# EAGLE design dresden_breakout_v04 (EAGLE 5.10)
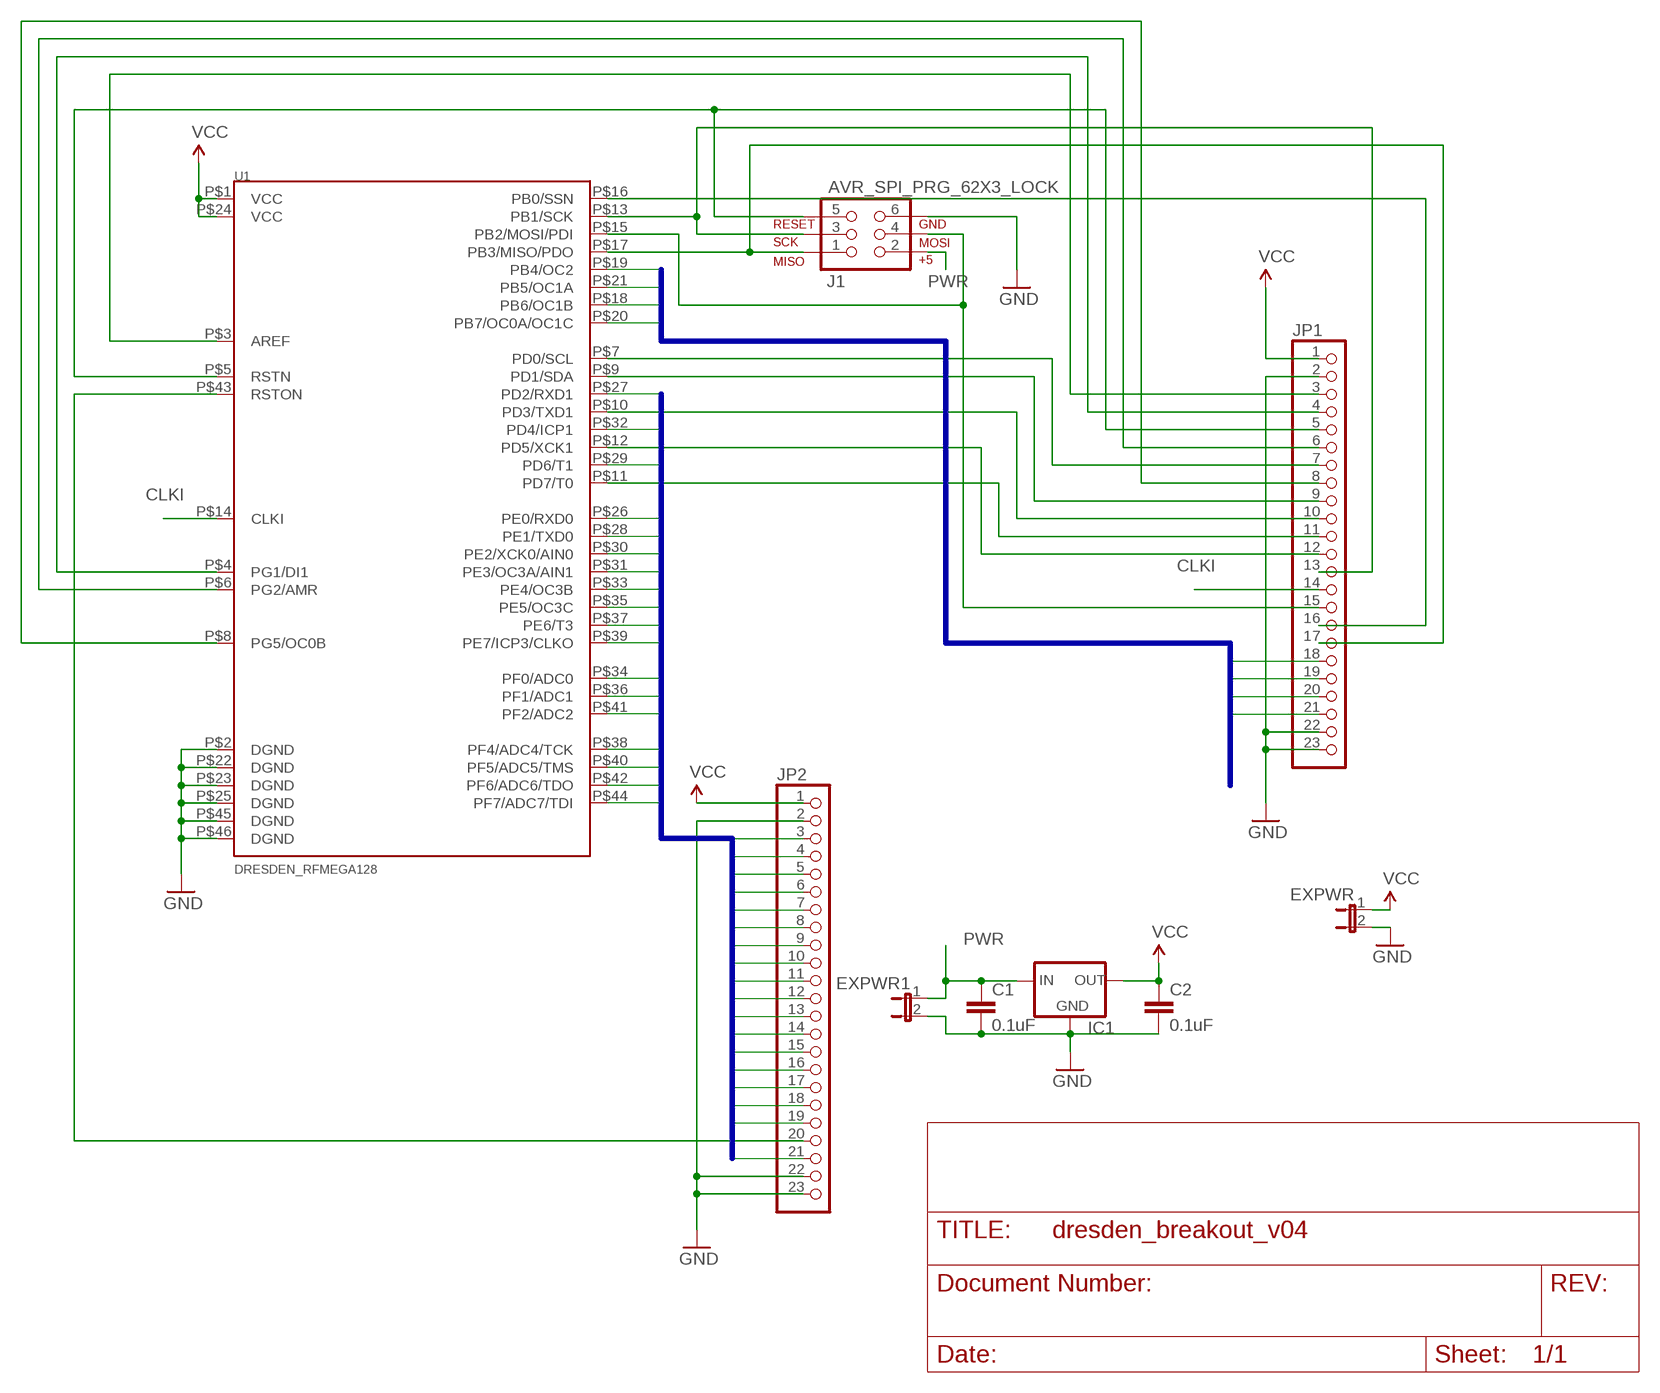
[diagram p0: schematic, sheet 1]

## Parts
C1  0.1uF  C-EU050-035X075  [C050-035X075]
C2  0.1uF  C-EU050-035X075  [C050-035X075]
EXPWR  JUMPER2  [JUMPER2]
EXPWR1  JUMPER2  [JUMPER2]
IC1  MCP1700INLINE  [TO92-INLINE]
J1  AVR_SPI_PRG_62X3_LOCK  [2X3_LOCK]
JP1  PINHD-1X23NS  [1X23-NS]
JP2  PINHD-1X23NS  [1X23-NS]
U1  DRESDEN_RFMEGA128  [DRESDEN-DERFMEGA128-TOPSIDE]

## Nets
CLKI: JP1.14 U1.P$14(CLKI)
GND: C1.2 C2.2 EXPWR1.2 EXPWR.2 IC1.1(GND) J1.6 JP1.2 JP1.22 JP1.23 JP2.2 JP2.22 JP2.23 U1.P$2(DGND) U1.P$22(DGND) U1.P$23(DGND) U1.P$25(DGND) U1.P$45(DGND) U1.P$46(DGND)
MISO: J1.1 JP1.17 U1.P$17(PB3/MISO/PDO)
MOSI: J1.4 JP1.15 U1.P$15(PB2/MOSI/PDI)
N$1: JP1.7 U1.P$7(PD0/SCL)
N$2: JP1.12 U1.P$12(PD5/XCK1)
N$54: JP2.20 U1.P$43(RSTON)
N$65: JP1.9 U1.P$9(PD1/SDA)
N$66: JP1.3 U1.P$3(AREF)
N$67: JP1.4 U1.P$4(PG1/DI1)
N$68: JP1.6 U1.P$6(PG2/AMR)
N$69: JP1.8 U1.P$8(PG5/OC0B)
N$70: JP1.10 U1.P$10(PD3/TXD1)
N$72: JP1.11 U1.P$11(PD7/T0)
N$74: JP1.16 U1.P$16(PB0/SSN)
PIN18: JP1.18 U1.P$18(PB6/OC1B)
PIN19: JP1.19 U1.P$19(PB4/OC2)
PIN20: JP1.20 U1.P$20(PB7/OC0A/OC1C)
PIN21: JP1.21 U1.P$21(PB5/OC1A)
PIN26: JP2.3 U1.P$26(PE0/RXD0)
PIN27: JP2.4 U1.P$27(PD2/RXD1)
PIN28: JP2.5 U1.P$28(PE1/TXD0)
PIN29: JP2.6 U1.P$29(PD6/T1)
PIN30: JP2.7 U1.P$30(PE2/XCK0/AIN0)
PIN31: JP2.8 U1.P$31(PE3/OC3A/AIN1)
PIN32: JP2.9 U1.P$32(PD4/ICP1)
PIN33: JP2.10 U1.P$33(PE4/OC3B)
PIN34: JP2.11 U1.P$34(PF0/ADC0)
PIN35: JP2.12 U1.P$35(PE5/OC3C)
PIN36: JP2.13 U1.P$36(PF1/ADC1)
PIN37: JP2.14 U1.P$37(PE6/T3)
PIN38: JP2.15 U1.P$38(PF4/ADC4/TCK)
PIN39: JP2.16 U1.P$39(PE7/ICP3/CLKO)
PIN40: JP2.17 U1.P$40(PF5/ADC5/TMS)
PIN41: JP2.18 U1.P$41(PF2/ADC2)
PIN42: JP2.19 U1.P$42(PF6/ADC6/TDO)
PIN44: JP2.21 U1.P$44(PF7/ADC7/TDI)
PWR: C1.1 EXPWR1.1 IC1.2(IN) J1.2
RESET: J1.5 JP1.5 U1.P$5(RSTN)
SCK: J1.3 JP1.13 U1.P$13(PB1/SCK)
VCC: C2.1 EXPWR.1 IC1.3(OUT) JP1.1 JP2.1 U1.P$1(VCC) U1.P$24(VCC)

## Buses
PIN[18..21]
PIN[26..42],PIN44

## Library data of the parts
C1 C2 = rcl:C-EU: CAPACITOR, European symbol
EXPWR EXPWR1 = microbuilder:JUMPER2: JUMPER - 2 Pins
IC1 = adafruit:MCP1700: VOLTAGE REGULATOR
J1 = SparkFun:AVR_SPI_PRG_6: AVR ISP 6 Pin This is the reduced ISP connector for AVR programming. Common on Arduino. This footprint will take up less PCB space and can be used with a 10-pin to 6-pin adapter such as SKU: BOB-08508
JP1 JP2 = karlnet-parts:PINHD-1X23: PIN HEADER
U1 = karlnet-parts:DRESDEN_RFMEGA128: This is a modified ATmega128RFA1 part, to to match Dresden Elektronik's deRFmega128-22XX modules

## Board
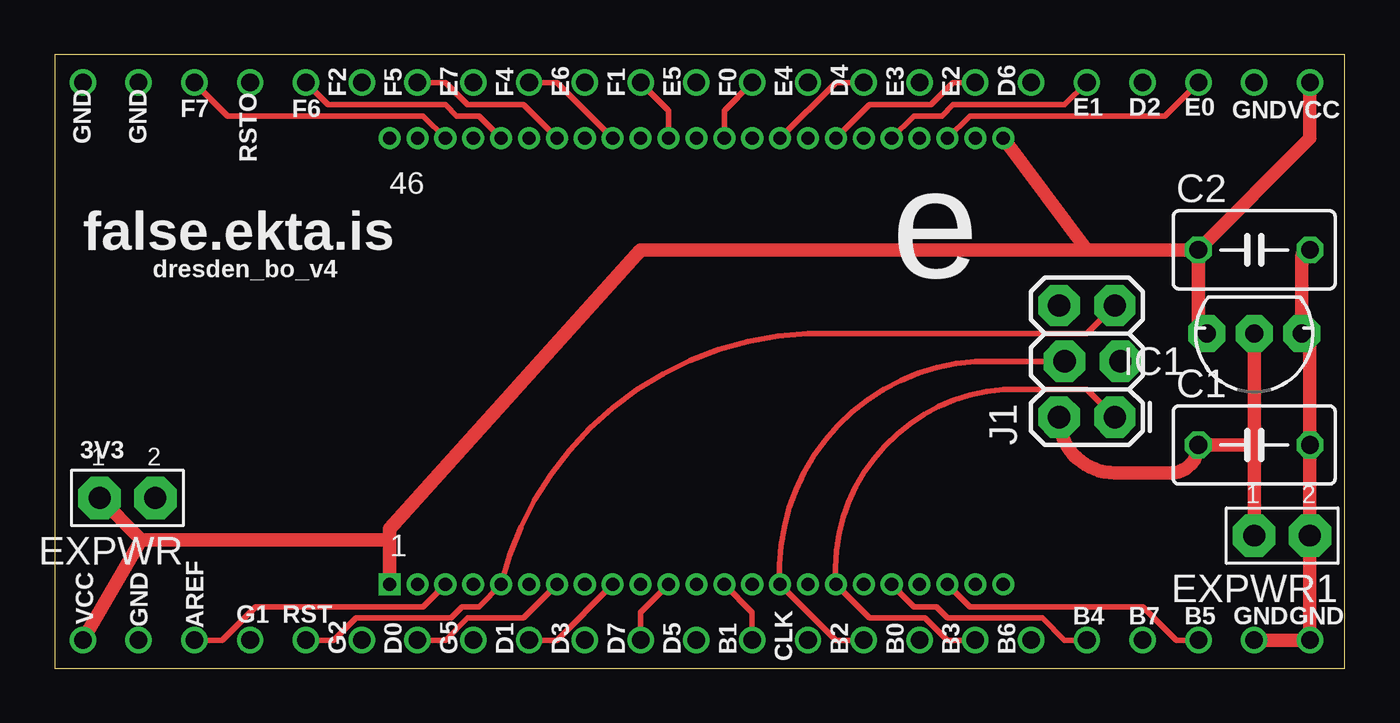
[diagram p1: board, top side]
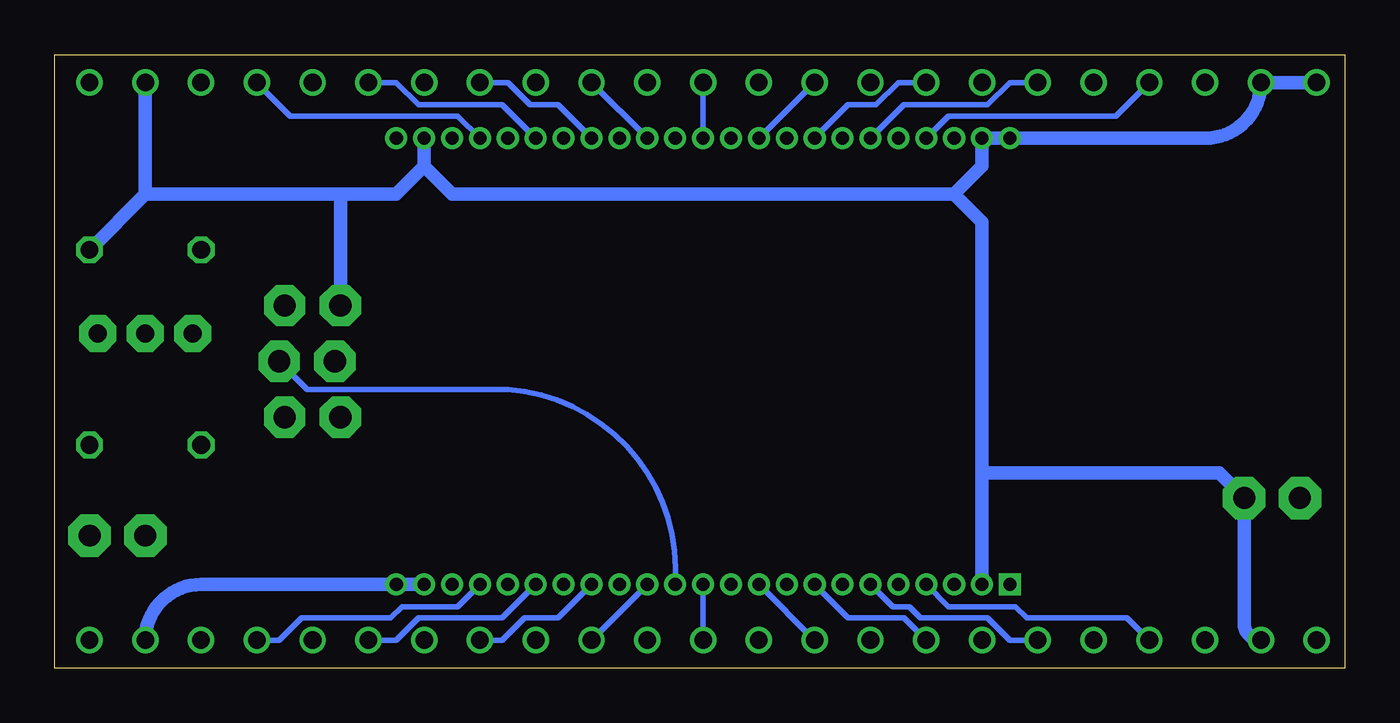
[diagram p2: board, bottom side, seen from below]

Size 58.72 x 27.93 mm. Coordinates in mm from the lower left corner, seen from the top.
Outline: 0,0 58.72,0 58.72,27.93 0,27.93 0,0
Copper layers (1*16): Top 0.0356mm / dielectric 1.5011mm / Bottom 0.0356mm
Design rules "dorkbot__LaenPCBOrder": minimum track width 6mil, minimum drill 13mil, track to track 6mil, track to pad 6mil, pad to pad 6mil, via to via 6mil, smd to smd 6mil, copper to edge 15mil, drill to drill 6mil, minimum pad ring 7mil, minimum via ring 7mil, stop-mask expansion 4mil, vias tented up to drill 0mil, thermal gap 10mil

### Footprints (pad centres in the part's own frame; a part is rotated, then mirrored left to right if it is on the bottom)
C050-035X075 = drill 0.813 octagon: 1 -2.54,0; 2 2.54,0
JUMPER2 = drill 1 pad 1.93 octagon: 1 2.54,0; 2 0,0
TO92-INLINE = drill 0.813 pad 1.676 octagon: 1 -2.159,0; 2 0,0; 3 2.159,0
2X3_LOCK = drill 1.016 pad 1.88 octagon: 1 0,0; 2 0,2.54; 3 2.54,-0.254; 4 2.54,2.286; 5 5.08,0; 6 5.08,2.54
1X23-NS = drill 0.8 round: 1 0,0; 2 2.54,0; 3 5.08,0; 4 7.62,0; 5 10.16,0; 6 12.7,0; 7 15.24,0; 8 17.78,0; 9 20.32,0; 10 22.86,0; 11 25.4,0; 12 27.94,0; 13 30.48,0; 14 33.02,0; 15 35.56,0; 16 38.1,0; 17 40.64,0; 18 43.18,0; 19 45.72,0; 20 48.26,0; 21 50.8,0; 22 53.34,0; 23 55.88,0
DRESDEN-DERFMEGA128-TOPSIDE = drill 0.6 pad 1.006 square: P$1 0,0 | drill 0.6 pad 1.006 round: P$2 1.27,0; P$3 2.54,0; P$4 3.81,0; P$5 5.08,0; P$6 6.35,0; P$7 7.62,0; P$8 8.89,0; P$9 10.16,0; P$10 11.43,0; P$11 12.7,0; P$12 13.97,0; P$13 15.24,0; P$14 16.51,0; P$15 17.78,0; P$16 19.05,0; P$17 20.32,0; P$18 21.59,0; P$19 22.86,0; P$20 24.13,0; P$21 25.4,0; P$22 26.67,0; P$23 27.94,0; P$24 27.94,20.32; P$25 26.67,20.32; P$26 25.4,20.32; P$27 24.13,20.32; P$28 22.86,20.32; P$29 21.59,20.32; P$30 20.32,20.32; P$31 19.05,20.32; P$32 17.78,20.32; P$33 16.51,20.32; P$34 15.24,20.32; P$35 13.97,20.32; P$36 12.7,20.32; P$37 11.43,20.32; P$38 10.16,20.32; P$39 8.89,20.32; P$40 7.62,20.32; P$41 6.35,20.32; P$42 5.08,20.32; P$43 3.81,20.32; P$44 2.54,20.32; P$45 1.27,20.32; P$46 0,20.32

### Placement (x,y rotation side)
C1  54.61,10.16 0 top
C2  54.61,19.05 0 top
EXPWR  4.57,7.75 180 top
EXPWR1  57.15,6.03 180 top
IC1  54.61,15.24 180 top
J1  48.26,11.43 90 top
JP1  1.27,1.27 0 top
JP2  57.15,26.67 180 top
U1  15.24,3.81 0 top

### Tracks (layer width: path | path; a pad name or v marks a point on that pad's centre or on a via)
CLKI
  Bottom 0.254: U1.P$14 JP1.14
GND
  Top 0.61: JP1.22 JP1.23 EXPWR1.2 C1.2 57.15,14.86 arc90 IC1.1 56.77,18.67 arc-90 C2.2
  Bottom 0.61: 54.61,21.59 C2.2 | 54.61,21.59 JP2.2 | 45.72,21.59 J1.6 | 45.72,21.59 54.61,21.59 | 45.72,21.59 43.18,21.59 41.91,22.86 | 41.91,22.86 U1.P$25 | 41.91,22.86 40.64,21.59 17.78,21.59 | JP1.22 arc90 52.07,3.81 U1.P$23 U1.P$22 | 17.78,21.59 16.51,22.86 U1.P$45 U1.P$46 6.35,24.13 arc-90 JP2.22 JP2.23 | 16.51,8.89 U1.P$2 | 16.51,8.89 16.51,20.32 17.78,21.59 | 16.51,8.89 5.71,8.89 EXPWR.2 4.57,2.03 arc-90 JP1.2
MISO
  Top 0.254: J1.1 46.99,12.7 43.18,12.7 arc90 U1.P$17 37.08,2.29 39.62,2.29 40.64,1.27 JP1.17
MOSI
  Top 0.254: J1.4 41.91,13.97 arc90 U1.P$15 35.56,1.27 JP1.15
N$1
  Top 0.254: U1.P$7 21.34,2.29 18.8,2.29 17.78,1.27 JP1.7
N$2
  Bottom 0.254: U1.P$12 JP1.12
N$54
  Bottom 0.254: U1.P$43 18.03,25.15 10.41,25.15 JP2.20
N$65
  Top 0.254: U1.P$9 22.86,1.27 JP1.9
N$66
  Top 0.254: U1.P$3 16.76,2.79 9.14,2.79 7.62,1.27 JP1.3
N$67
  Bottom 0.254: U1.P$4 18.03,2.79 14.99,2.79 14.48,2.29 9.91,2.29 JP1.4
N$68
  Bottom 0.254: U1.P$6 20.57,2.79 19.81,2.79 19.3,2.29 16.26,2.29 15.24,1.27 JP1.6
N$69
  Bottom 0.254: U1.P$8 22.61,2.29 20.07,2.29 JP1.8
N$70
  Bottom 0.254: U1.P$10 JP1.10
N$72
  Top 0.254: U1.P$11 26.67,2.54 JP1.11
N$74
  Bottom 0.254: U1.P$16 35.81,2.29 37.34,2.29 38.35,1.27 JP1.16
PIN18
  Bottom 0.254: U1.P$18 38.35,2.29 42.16,2.29 43.18,1.27 JP1.18
PIN19
  Top 0.254: U1.P$19 39.12,2.79 40.13,2.79 40.64,2.29 44.96,2.29 45.97,1.27 JP1.19
PIN20
  Bottom 0.254: U1.P$20 40.39,2.79 42.93,2.79 43.43,2.29 47.5,2.29 48.51,1.27 JP1.20
PIN21
  Top 0.254: U1.P$21 41.66,2.79 49.53,2.79 51.05,1.27 JP1.21
PIN26
  Top 0.254: U1.P$26 41.66,25.15 50.55,25.15 JP2.3
PIN27
  Bottom 0.254: U1.P$27 40.39,25.15 48.01,25.15 JP2.4
PIN28
  Top 0.254: U1.P$28 39.12,25.15 40.39,25.15 40.89,25.65 45.97,25.65 JP2.5
PIN29
  Bottom 0.254: U1.P$29 38.35,25.65 42.16,25.65 43.18,26.67 JP2.6
PIN30
  Top 0.254: U1.P$30 37.08,25.65 39.88,25.65 40.89,26.67 JP2.7
PIN31
  Bottom 0.254: U1.P$31 35.81,25.65 37.08,25.65 38.1,26.67 JP2.8
PIN32
  Top 0.254: U1.P$32 35.56,26.67 JP2.9
PIN33
  Bottom 0.254: U1.P$33 JP2.10
PIN34
  Top 0.254: U1.P$34 30.48,25.4 JP2.11
PIN35
  Bottom 0.254: U1.P$35 JP2.12
PIN36
  Top 0.254: U1.P$36 27.94,25.4 JP2.13
PIN37
  Bottom 0.254: U1.P$37 JP2.14
PIN38
  Top 0.254: U1.P$38 22.86,26.67 JP2.15
PIN39
  Bottom 0.254: U1.P$39 22.61,25.65 21.34,25.65 20.32,26.67 JP2.16
PIN40
  Top 0.254: U1.P$40 21.34,25.65 18.8,25.65 17.78,26.67 JP2.17
PIN41
  Bottom 0.254: U1.P$41 20.07,25.65 16.26,25.65 15.24,26.67 JP2.18
PIN42
  Top 0.254: U1.P$42 19.3,25.15 18.29,25.15 17.78,25.65 12.45,25.65 JP2.19
PIN44
  Top 0.254: U1.P$44 16.76,25.15 7.87,25.15 JP2.21
PWR
  Top 0.61: 54.61,10.16 EXPWR1.1 | 54.61,10.16 IC1.2 | 54.61,10.16 C1.1 arc-90 50.8,8.89 48.26,8.89 arc-90 J1.2
RESET
  Top 0.254: J1.5 46.99,15.24 34.29,15.24 arc74 U1.P$5 19.3,2.79 18.54,2.79 18.03,2.29 13.72,2.29 12.7,1.27 JP1.5
SCK
  Top 0.254: U1.P$13 31.75,2.54 JP1.13
  Bottom 0.254: J1.3 47.24,12.7 38.1,12.7 arc90 U1.P$13
VCC
  Top 0.61: C2.1 52.07,15.62 arc90 IC1.3 | C2.1 57.15,24.13 JP2.1 | 46.99,19.05 C2.1 | 46.99,19.05 U1.P$24 | 15.24,5.84 U1.P$1 | 15.24,5.84 15.24,6.35 26.67,19.05 46.99,19.05 | EXPWR.1 3.94,5.84 | 3.94,5.84 15.24,5.84 | JP1.1 3.94,5.84

### Text on the board
tPlace: F2 | F5 | E7 | F4 | E6 | F1 | E5 | F0 | E4 | D4 | E3 | E2 | D6 | F7 | F6 | E1 | D2 | E0 | GND | VCC | GND | GND | RSTO | false.ekta.is | dresden_bo_v4 | 3V3 | AREF | VCC | GND | G1 | RST | B4 | B7 | B5 | GND | GND | G2 | D0 | G5 | D1 | D3 | D7 | D5 | B1 | B2 | B0 | B3 | B6 | CLK